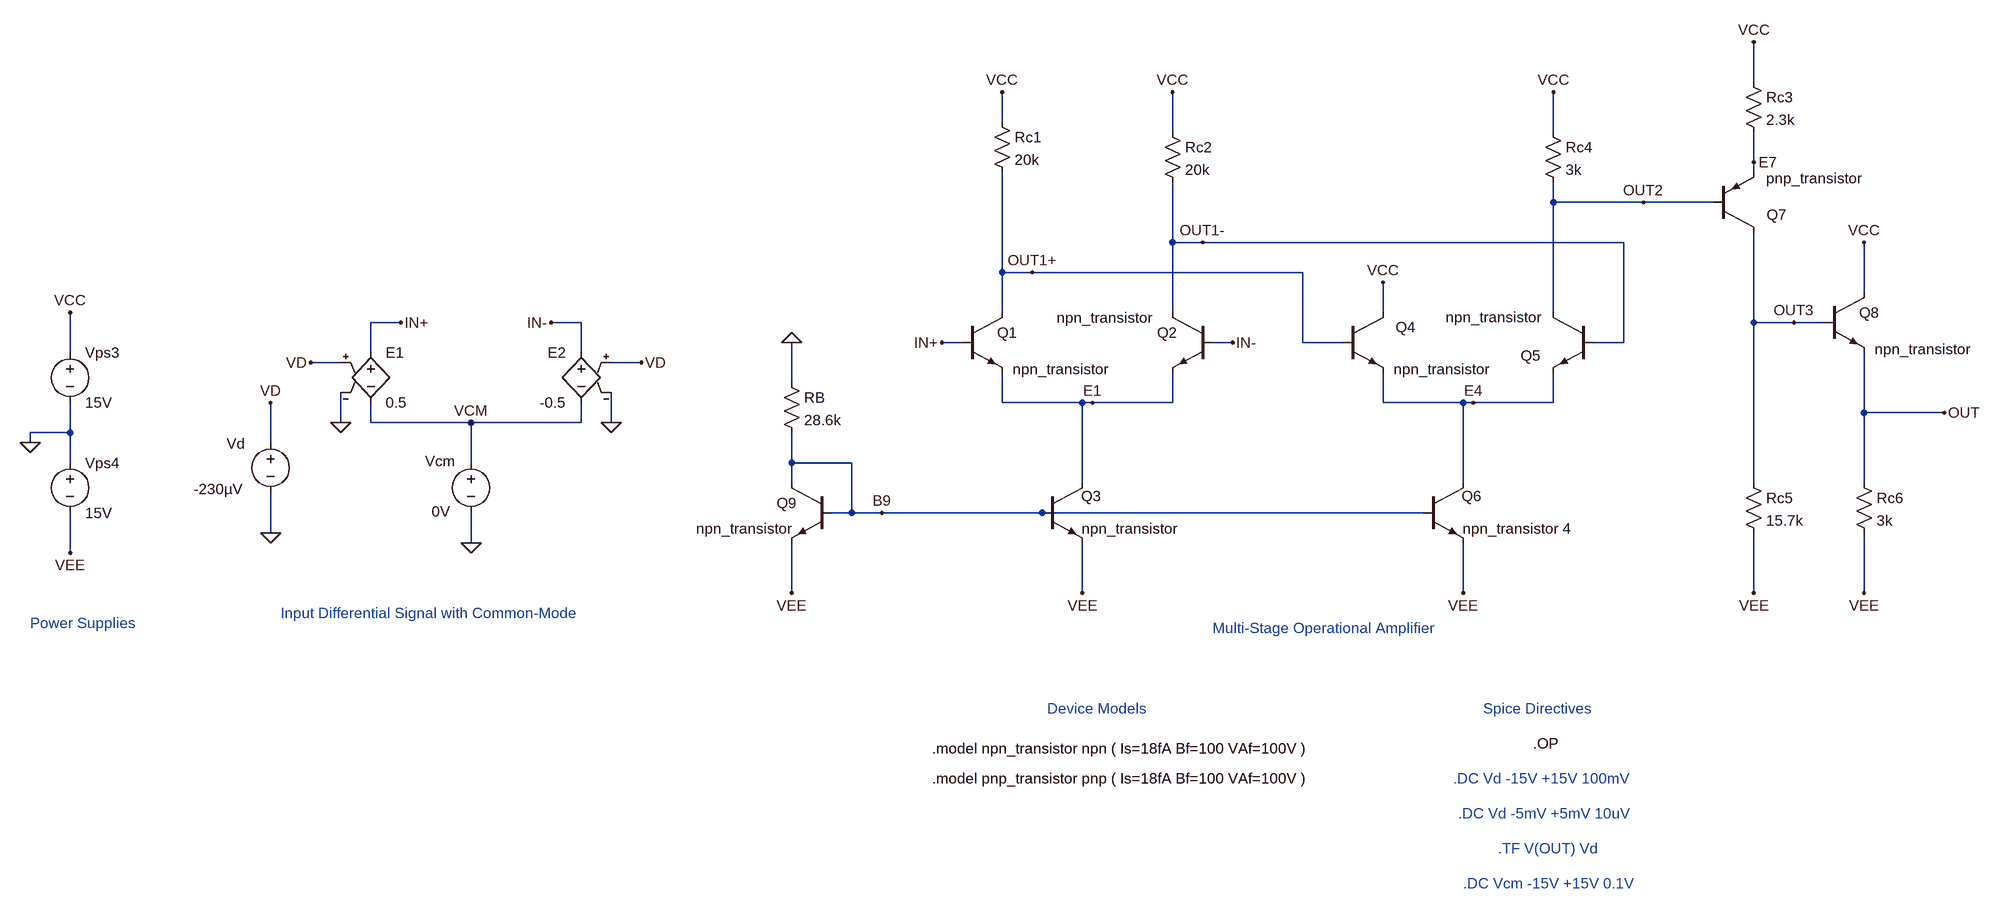
[diagram p0: schematic multistage_amplifier_b.asc]
multistage_amplifier_b.asc, the LTspice schematic file:
Version 4
SHEET 1 2876 1032
WIRE 2480 -368 2480 -432
WIRE 1280 -304 1280 -352
WIRE 1552 -288 1552 -352
WIRE 2160 -288 2160 -352
WIRE 2480 -240 2480 -288
WIRE 2480 -224 2480 -240
WIRE 2160 -176 2160 -208
WIRE 2304 -176 2160 -176
WIRE 2416 -176 2304 -176
WIRE 1552 -112 1552 -208
WIRE 1600 -112 1552 -112
WIRE 2272 -112 1600 -112
WIRE 1280 -64 1280 -224
WIRE 1328 -64 1280 -64
WIRE 1760 -64 1328 -64
WIRE 2656 -32 2656 -112
WIRE 1280 0 1280 -64
WIRE 1552 0 1552 -112
WIRE 1888 0 1888 -48
WIRE 2160 0 2160 -176
WIRE 320 16 272 16
WIRE 608 16 560 16
WIRE 2480 16 2480 -128
WIRE 2544 16 2480 16
WIRE 2592 16 2544 16
WIRE 1216 48 1184 48
WIRE 1648 48 1616 48
WIRE 1760 48 1760 -64
WIRE 1824 48 1760 48
WIRE 2272 48 2272 -112
WIRE 2272 48 2224 48
WIRE -208 64 -208 0
WIRE 272 64 272 16
WIRE 608 64 608 16
WIRE 224 80 176 80
WIRE 704 80 656 80
WIRE 944 112 944 48
WIRE 1280 144 1280 96
WIRE 1408 144 1280 144
WIRE 1424 144 1408 144
WIRE 1552 144 1552 96
WIRE 1552 144 1424 144
WIRE 1888 144 1888 96
WIRE 2016 144 1888 144
WIRE 2032 144 2016 144
WIRE 2160 144 2160 96
WIRE 2160 144 2032 144
WIRE 2656 160 2656 64
WIRE 2784 160 2656 160
WIRE 224 176 224 128
WIRE 272 176 272 144
WIRE 432 176 272 176
WIRE 608 176 608 144
WIRE 608 176 432 176
WIRE 656 176 656 128
WIRE -208 192 -208 144
WIRE -208 192 -272 192
WIRE -272 208 -272 192
WIRE 112 208 112 144
WIRE -208 240 -208 192
WIRE 432 240 432 176
WIRE 944 240 944 192
WIRE 1040 240 944 240
WIRE 944 272 944 240
WIRE 1408 272 1408 144
WIRE 2016 272 2016 144
WIRE 2480 272 2480 16
WIRE 2656 272 2656 160
WIRE 1040 320 1040 240
WIRE 1040 320 1008 320
WIRE 1088 320 1040 320
WIRE 1344 320 1088 320
WIRE 1952 320 1344 320
WIRE 112 352 112 288
WIRE 432 368 432 320
WIRE -208 384 -208 320
WIRE 944 448 944 368
WIRE 1408 448 1408 368
WIRE 2016 448 2016 368
WIRE 2480 448 2480 352
WIRE 2656 448 2656 352
FLAG 1280 -352 VCC
FLAG 1424 144 E1
FLAG 1552 -352 VCC
FLAG 1184 48 IN+
FLAG 1648 48 IN-
FLAG 1328 -64 OUT1+
FLAG 1600 -112 OUT1-
FLAG -272 208 0
FLAG -208 0 VCC
FLAG -208 384 VEE
FLAG 560 16 IN-
FLAG 432 368 0
FLAG 224 176 0
FLAG 656 176 0
FLAG 704 80 VD
FLAG 432 176 VCM
FLAG 176 80 VD
FLAG 320 16 IN+
FLAG 112 352 0
FLAG 112 144 VD
FLAG 1888 -48 VCC
FLAG 2032 144 E4
FLAG 2160 -352 VCC
FLAG 2304 -176 OUT2
FLAG 2480 -432 VCC
FLAG 2656 -112 VCC
FLAG 2784 160 OUT
FLAG 2544 16 OUT3
FLAG 944 448 VEE
FLAG 1408 448 VEE
FLAG 2480 448 VEE
FLAG 2656 448 VEE
FLAG 944 48 0
FLAG 2480 -240 E7
FLAG 1088 320 B9
FLAG 2016 448 VEE
SYMBOL npn 1216 0 R0
WINDOW 3 81 90 Left 2
SYMATTR Value npn_transistor
SYMATTR InstName Q1
SYMBOL npn 1616 0 M0
WINDOW 3 95 8 Left 2
SYMATTR Value npn_transistor
SYMATTR InstName Q2
SYMBOL res 1264 -320 R0
SYMATTR InstName Rc1
SYMATTR Value 20k
SYMBOL res 1536 -304 R0
SYMATTR InstName Rc2
SYMATTR Value 20k
SYMBOL voltage -208 48 R0
SYMATTR InstName Vps3
SYMATTR Value 15V
SYMBOL voltage -208 224 R0
SYMATTR InstName Vps4
SYMATTR Value 15V
SYMBOL voltage 432 224 R0
WINDOW 0 -73 13 Left 2
WINDOW 3 -63 94 Left 2
SYMATTR InstName Vcm
SYMATTR Value 0V
SYMBOL e 272 48 R0
SYMATTR InstName E1
SYMATTR Value 0.5
SYMBOL e 608 48 M0
SYMATTR InstName E2
SYMATTR Value -0.5
SYMBOL voltage 112 192 R0
WINDOW 0 -70 17 Left 2
WINDOW 3 -123 90 Left 2
SYMATTR InstName Vd
SYMATTR Value -230µV
SYMBOL npn 1344 272 R0
WINDOW 3 63 73 Left 2
WINDOW 0 62 21 Left 2
SYMATTR Value npn_transistor
SYMATTR InstName Q3
SYMBOL npn 1008 272 M0
WINDOW 3 63 73 Left 2
SYMATTR Value npn_transistor
SYMATTR InstName Q9
SYMBOL res 928 96 R0
SYMATTR InstName RB
SYMATTR Value 28.6k
SYMBOL npn 1824 0 R0
WINDOW 3 81 90 Left 2
WINDOW 0 84 23 Left 2
SYMATTR Value npn_transistor
SYMATTR InstName Q4
SYMBOL npn 2224 0 M0
WINDOW 3 82 7 Left 2
WINDOW 0 84 69 Left 2
SYMATTR Value npn_transistor
SYMATTR InstName Q5
SYMBOL res 2144 -304 R0
SYMATTR InstName Rc4
SYMATTR Value 3k
SYMBOL npn 2592 -32 R0
WINDOW 3 81 90 Left 2
SYMATTR Value npn_transistor
SYMATTR InstName Q8
SYMBOL pnp 2416 -128 M180
WINDOW 0 85 28 Left 2
WINDOW 3 84 87 Left 2
SYMATTR InstName Q7
SYMATTR Value pnp_transistor
SYMBOL res 2464 -384 R0
SYMATTR InstName Rc3
SYMATTR Value 2.3k
SYMBOL res 2464 256 R0
SYMATTR InstName Rc5
SYMATTR Value 15.7k
SYMBOL res 2640 256 R0
SYMATTR InstName Rc6
SYMATTR Value 3k
SYMBOL npn 1952 272 R0
WINDOW 3 63 73 Left 2
WINDOW 0 62 21 Left 2
SYMATTR Value npn_transistor 4
SYMATTR InstName Q6
TEXT 1168 696 Left 2 !.model npn_transistor npn ( Is=18fA Bf=100 VAf=100V )
TEXT 2128 688 Left 2 !.OP
TEXT -272 496 Left 2 ;Power Supplies
TEXT 128 480 Left 2 ;Input Differential Signal with Common-Mode
TEXT 1616 504 Left 2 ;Multi-Stage Operational Amplifier
TEXT 1352 632 Left 2 ;Device Models
TEXT 2048 632 Left 2 ;Spice Directives
TEXT 1168 744 Left 2 !.model pnp_transistor pnp ( Is=18fA Bf=100 VAf=100V )
TEXT 2000 744 Left 2 ;.DC Vd -15V +15V 100mV
TEXT 2008 800 Left 2 ;.DC Vd -5mV +5mV 10uV
TEXT 2072 856 Left 2 ;.TF V(OUT) Vd
TEXT 2016 912 Left 2 ;.DC Vcm -15V +15V 0.1V

The netlist it stands for:
* multistage_amplifier_b.asc
Q1 OUT1+ IN+ E1 0 npn_transistor
Q2 OUT1- IN- E1 0 npn_transistor
Rc1 VCC OUT1+ 20k
Rc2 VCC OUT1- 20k
Vps3 VCC 0 15V
Vps4 0 VEE 15V
Vcm VCM 0 0V
E1 IN+ VCM VD 0 0.5
E2 IN- VCM VD 0 -0.5
Vd VD 0 -230µV
Q3 E1 B9 VEE 0 npn_transistor
Q9 B9 B9 VEE 0 npn_transistor
RB 0 B9 28.6k
Q4 VCC OUT1+ E4 0 npn_transistor
Q5 OUT2 OUT1- E4 0 npn_transistor
Rc4 VCC OUT2 3k
Q8 VCC OUT3 OUT 0 npn_transistor
Q7 OUT3 OUT2 E7 0 pnp_transistor
Rc3 VCC E7 2.3k
Rc5 OUT3 VEE 15.7k
Rc6 OUT VEE 3k
Q6 E4 B9 VEE 0 npn_transistor 4
.model NPN NPN
.model PNP PNP
.lib standard.bjt
.model npn_transistor npn ( Is=18fA Bf=100 VAf=100V )
.OP
* Power Supplies
* Input Differential Signal with Common-Mode
* Multi-Stage Operational Amplifier
* Device Models
* Spice Directives
.model pnp_transistor pnp ( Is=18fA Bf=100 VAf=100V )
* .DC Vd -15V +15V 100mV
* .DC Vd -5mV +5mV 10uV
* .TF V(OUT) Vd
* .DC Vcm -15V +15V 0.1V
.backanno
.end